# Altium schematic sheet LED_Buzzer.SchDoc: MoonPilot - LED & Buzzer
size A3; DrawnBy: Máni Magnússon; Revision: A; SheetNumber: 10
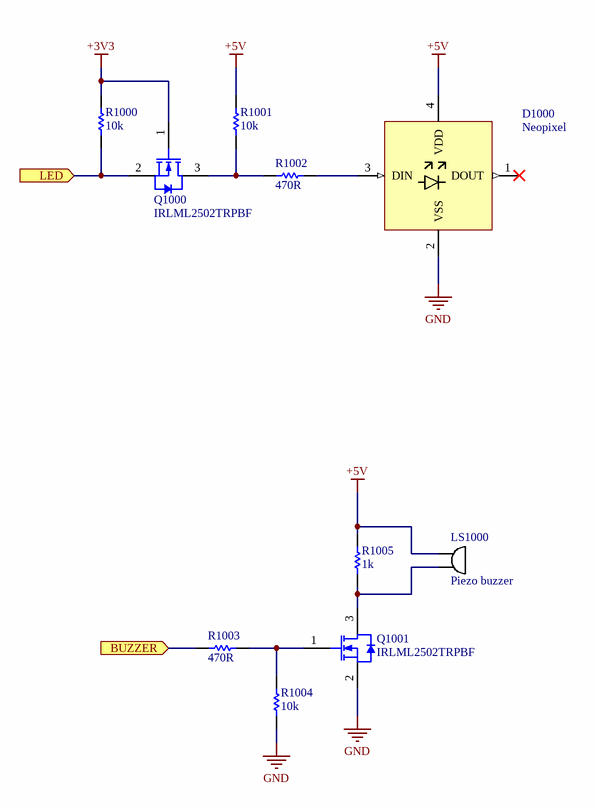
[diagram p0: LED_Buzzer.SchDoc]

## Parts
D1000  Neopixel  [2659]
LS1000  Piezo buzzer  [CPT-9019S-SMT-TR]
Q1000  IRLML2502TRPBF  [INTR-SOT-23-3_V]
Q1001  IRLML2502TRPBF  [INTR-SOT-23-3_V]
R1000  10k  [0603_RES]
R1001  10k  [0603_RES]
R1002  470R  [0603_RES]
R1003  470R  [0603_RES]
R1004  10k  [0603_RES]
R1005  1k  [0603_RES]

## Ports
BUZZER (in), LED (in)

## Nets
+3V3: Q1000.1(G) R1000.2
+5V: D1000.4(VDD) LS1000.1 R1001.1 R1005.1
GND: D1000.2(VSS) Q1001.2(S) R1004.1
BUZZER: R1003.1 ; port BUZZER
LED: Q1000.2(S) R1000.1 ; port LED
NetD1000_3: D1000.3(DIN) R1002.2
NetLS1000_2: LS1000.2 Q1001.3(D) R1005.2
NetQ1000_3: Q1000.3(D) R1001.2 R1002.1
NetQ1001_1: Q1001.1(G) R1003.2 R1004.2

Not connected (* = marked no-connect by the designer): D1000 1(DOUT)*

## Notes on the sheet
- Sheet title:
- Revision:
- Drawn by:
- Date:
- File:

## Library data of the parts
D1000 = Neopixel: Adafruit Neopixel SMD 3535 / Adafruit part no. 2659 / Digikey part no. 1528-1542-ND; MF: Adafruit Industries; MP: 2659; SnapEDA_Link: https://www.snapeda.com/parts/2659/Adafruit%20Industries%20LLC/view-part/548522/?ref=snap; Package: TQFP-32 Adafruit Industries; Digi-Key_Purchase_URL: https://www.digikey.com/product-detail/en/pololu-corporation/2659/2183-2659-ND/10451102?utm_source=snapeda&utm_medium=aggregator&utm_campaign=symbol; Digi-Key_Part_Number: 2183-2659-ND; Value: *
LS1000 = Buzzer: 4kHz 65 dB @ 3V passive piezoelectric buzzer; Supplier 1: Digi-Key; Supplier Part Number 1: 102-3761-1-ND
Q1000 Q1001 = IRLML2502TRPBF: N-Channel HEXFET(R) Power MOSFET, 20 V VDS, +/- 12 V VGS, 4.2 A, 3-Pin SOT23, RoHS, Tape and Reel; Manufacturer: International Rectifier; Drain-to-Source Voltage [Vdss]: 20V; Drain-Source On Resistance-Max: 0.045O; Qg Gate Charge: 8nC; Rated Power Dissipation: 1.25W; Package Reference: SOT-23-3; Manufacturer URL: http://internationalrectifier.com/; Package Description: 3-Pin Small Outline Transistor, Body 2.92 x 1.3 mm, Pitch 0.95 mm; Datasheet Version: Apr-14; Channel Type: N-Channel; Datasheet URL: https://datasheet.ciiva.com/6383/irlml2502pbf-6383216.pdf
R1000-R1005 = Resistor